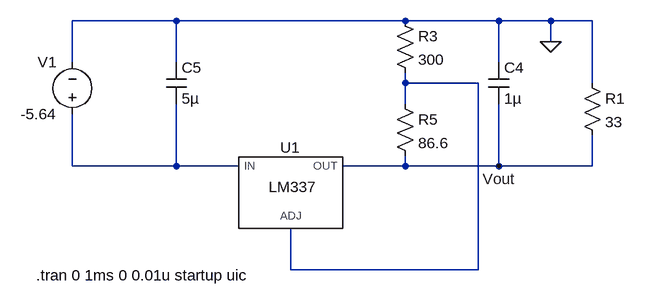
[diagram p0: schematic negative_3v3_regulator_testbench.asc]
negative_3v3_regulator_testbench.asc, the LTspice schematic file:
Version 4
SHEET 1 1556 772
WIRE 784 112 624 112
WIRE 1136 112 784 112
WIRE 1280 112 1136 112
WIRE 1360 112 1280 112
WIRE 1424 112 1360 112
WIRE 1360 144 1360 112
WIRE 624 176 624 112
WIRE 784 176 784 112
WIRE 1280 176 1280 112
WIRE 1136 208 1136 192
WIRE 1248 208 1136 208
WIRE 1424 208 1424 112
WIRE 1136 240 1136 208
WIRE 624 336 624 256
WIRE 784 336 784 240
WIRE 784 336 624 336
WIRE 880 336 784 336
WIRE 1136 336 1136 320
WIRE 1136 336 1040 336
WIRE 1280 336 1280 240
WIRE 1280 336 1136 336
WIRE 1424 336 1424 288
WIRE 1424 336 1280 336
WIRE 960 496 960 432
WIRE 1248 496 1248 208
WIRE 1248 496 960 496
FLAG 1360 144 0
FLAG 1280 336 Vout
SYMBOL LM337 960 368 R0
SYMATTR InstName U1
SYMBOL res 1120 96 R0
SYMATTR InstName R3
SYMATTR Value 300
SYMBOL res 1120 224 R0
SYMATTR InstName R5
SYMATTR Value 86.6
SYMBOL cap 1264 176 R0
SYMATTR InstName C4
SYMATTR Value 1µ
SYMBOL cap 768 176 R0
SYMATTR InstName C5
SYMATTR Value 5µ
SYMBOL voltage 624 272 R180
WINDOW 0 24 96 Left 2
WINDOW 3 24 16 Left 2
WINDOW 123 0 0 Left 0
WINDOW 39 0 0 Left 0
SYMATTR InstName V1
SYMATTR Value -5.64
SYMBOL res 1408 192 R0
SYMATTR InstName R1
SYMATTR Value 33
TEXT 568 504 Left 2 !.tran 0 1ms 0 0.01u startup uic

The netlist it stands for:
* negative_3v3_regulator_testbench.asc
XU1 N002 N001 Vout LM337  ; pins IN ADJ OUT
R3 0 N001 300
R5 N001 Vout 86.6
C4 0 Vout 1µ
C5 0 N002 5µ
V1 N002 0 -5.64
R1 0 Vout 33
.tran 0 1ms 0 0.01u startup uic
.lib LM337.sub
.backanno
.end